# Altium schematic sheet 存在感应灯控模块-24V-8位拨码V0.2.schdoc
size A3
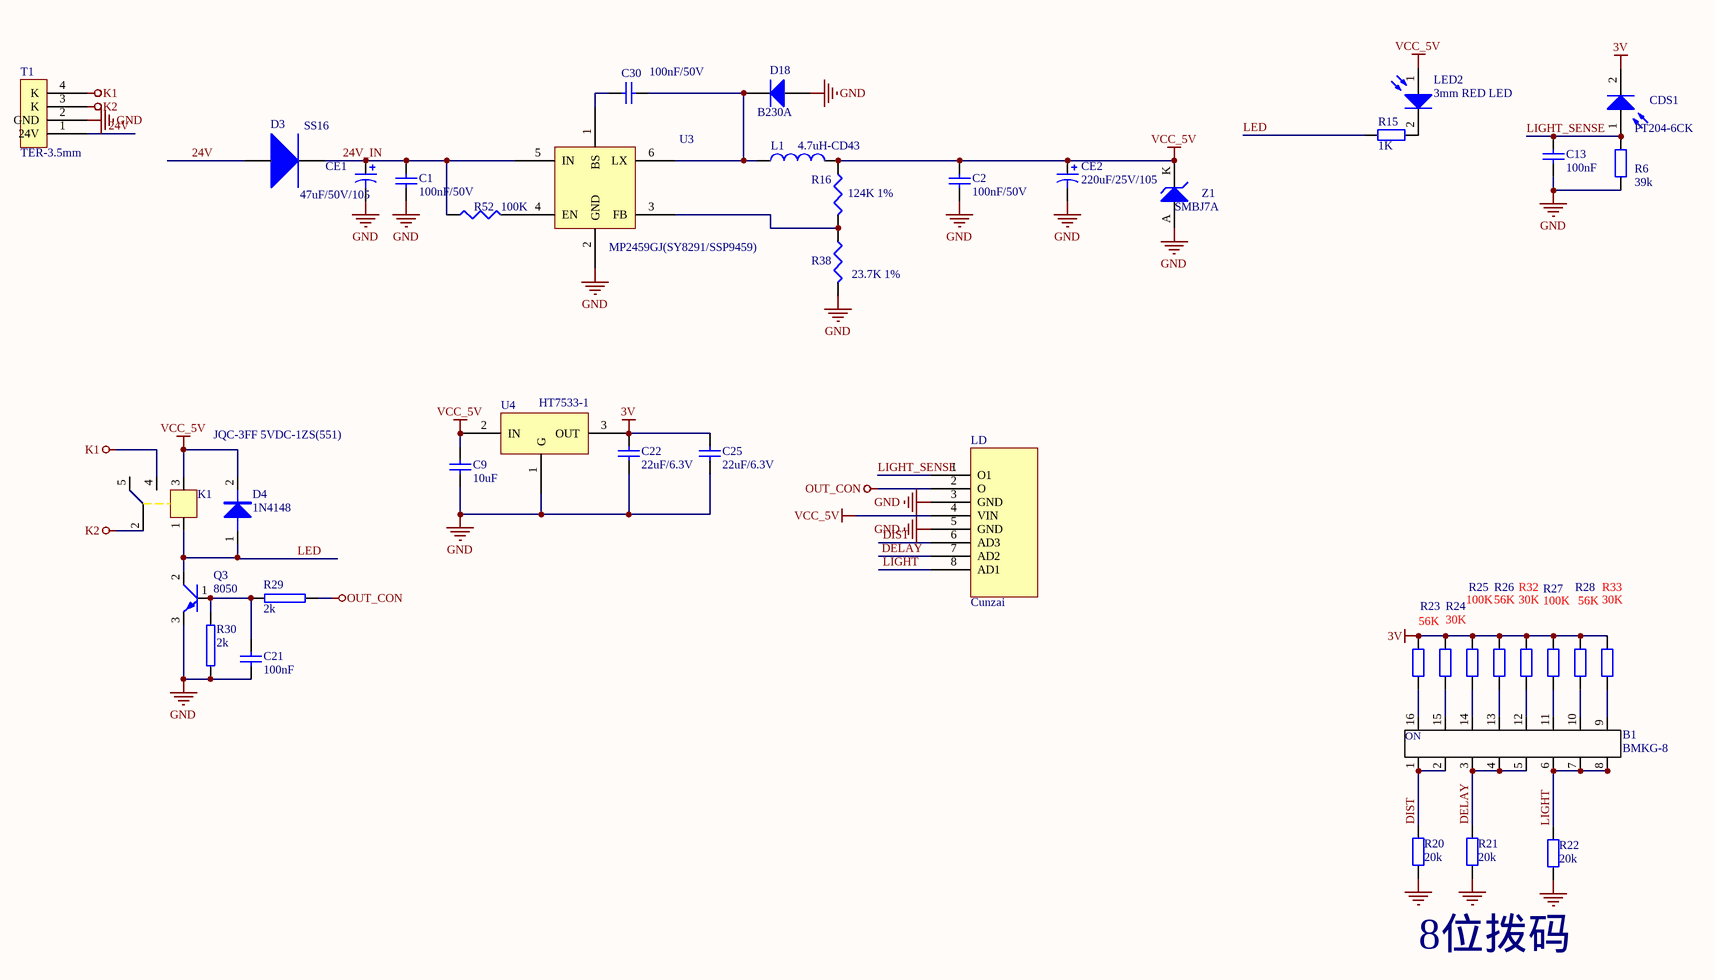
[diagram p0: 存在感应灯控模块-24V-8位拨码V0.2.schdoc]

## Parts
B1  BMKG-8  [BMKG-8]
C1  100nF/50V  [0603]
C2  100nF/50V  [0603]
C9  10uF  [C0603]
C13  100nF  [C0603]
C21  100nF  [C0603]
C22  22uF/6.3V  [C0603]
C25  22uF/6.3V  [C0603]
C30  100nF/50V  [0603]
CDS1  PT204-6CK  [LED-3MM]
CE1  47uF/50V/105  [DIPC6X12]
CE2  220uF/25V/105  [DIPC6X12]
D3  SS16  [SMA]
D4  1N4148  [SOD123]
D18  B230A  [SMA]
K1  JQC-3FF 5VDC-1ZS(551)  [JQC-3FF]
L1  4.7uH-CD43  [CDRH3D16]
LD  Cunzai  [LDCUNZAI]
LED2  3mm RED LED  [LED-3MM]
Q3  8050  [SOT23]
R6  value 39k  [R0603]  (hidden comment: Res2)
R15  value 1K  [R0603]  (hidden comment: Res2)
R16  124K 1%  [0603]
R20  20k  [R0603]
R21  20k  [R0603]
R22  20k  [R0603]
R23  56K  [R0603]
R24  30K  [R0603]
R25  100K  [R0603]
R26  56K  [R0603]
R27  100K  [R0603]
R28  56K  [R0603]
R29  2k  [SR0603]
R30  2k  [SR0603]
R32  30K  [R0603]
R33  30K  [R0603]
R38  23.7K 1%  [0603]
R52  100K  [0603]
T1  TER-3.5mm  [4-KKK]
U3  MP2459GJ(SY8291/SSP9459)  [SOT23-6]
U4  HT7533-1  [SOT-89]
Z1  SMBJ7A  [SMB]

## Nets
3V: C22.1 C25.1 CDS1.2(K) R23.2 R24.2 R25.2 R26.2 R27.2 R28.2 R32.2 R33.2 U4.3(OUT)
GND: C1.1 C2.1 C9.2 C13.1 C21.2 C22.2 C25.2 CE1.2 CE2.2 D18.1(A) LD.3(GND) LD.5(GND) Q3.3(C) R6.1 R20.1 R21.1 R22.1 R30.1 R38.2 T1.2(GND) U3.2(GND) U4.1(G) Z1.A
K1: K1.4 T1.4(K)
K2: K1.2 T1.3(K)
OUT_CON: LD.2(O) R29.2
VCC_5V: C2.2 C9.1 CE2.1 D4.2 K1.3 L1.2 LD.4(VIN) LED2.1(A) R16.1 U4.2(IN) Z1.K
24V: D3.1(B) T1.1(24V)
24V_IN: C1.2 CE1.1 D3.2(C) R52.1 U3.5(IN)
DELAY: B1.3 B1.4 B1.5 LD.7(AD2) R21.2
DIST: B1.1 B1.2 LD.6(AD3) R20.2
LED: D4.1 K1.1 Q3.2(E) R15.2
LIGHT: B1.6 B1.7 B1.8 LD.8(AD1) R22.2
LIGHT_SENSE: C13.2 CDS1.1(A) LD.1(O1) R6.2
NetB1_9: B1.9 R33.1
NetB1_10: B1.10 R28.1
NetB1_11: B1.11 R27.1
NetB1_12: B1.12 R32.1
NetB1_13: B1.13 R26.1
NetB1_14: B1.14 R25.1
NetB1_15: B1.15 R24.1
NetB1_16: B1.16 R23.1
NetC21_1: C21.1 Q3.1(B) R29.1 R30.2
NetC30_1: C30.1 D18.2(K) L1.1 U3.6(LX)
NetC30_2: C30.2 U3.1(BS)
NetLED2_2: LED2.2(K) R15.1
NetR16_2: R16.2 R38.1 U3.3(FB)
NetR52_2: R52.2 U3.4(EN)

Not connected (* = marked no-connect by the designer): K1 5

## Notes on the sheet
- 8位拨码
- (in symbol BMKG-8) ON

## Library data of the parts
C1 C2 C30 = Cap Semi: Capacitor (Semiconductor SIM Model); Published: 8-Jun-2000; LatestRevisionDate: 29-May-2009; LatestRevisionNote: IPC-7351 Footprint Added.; PackageReference: C1206; Publisher: Altium Limited; PackageDescription: Chip Capacitor; Value: 100nF/50V
C9 C13 C21 C22 C25 = Cap: Capacitor; Published: 8-Jun-2000; LatestRevisionDate: 17-Jul-2002; LatestRevisionNote: Re-released for DXP Platform.; PackageReference: RAD-0.3; Publisher: Altium Limited; PackageDescription: Radial Cap, Thru-Hole; 2 Leads; 0.3 in Pin Spacing
  C9: Value: 10uF
  C13 C21: Value: 100nF
  C22 C25: Value: 22uF/6.3V
CDS1 LED2 = Photo Sen: Photosensitive Diode; Published: 24-Mar-1999; LatestRevisionDate: 17-Jul-2002; LatestRevisionNote: Re-released for DXP Platform.; PackageReference: PIN2; Publisher: Altium Limited
  CDS1: Value: PT204-6CK
  LED2: Value: 3mm RED LED
CE1 CE2 = Cap Pol1: Polarized Capacitor (Radial); Published: 8-Jun-2000; LatestRevisionDate: 17-Jul-2002; LatestRevisionNote: Re-released for DXP Platform.; PackageReference: RB7.6-15; Publisher: Altium Limited
  CE1: Value: 47uF/50V/105
  CE2: Value: 220uF/25V/105
D3 = SS14: Value: SS16
D4 = DIODE
D18 = Diode 1N4007: 1 Amp General Purpose Rectifier; Revision 1: 11-Jul-2000: SIM Model Added.; Revision 2: 17-Jul-2002: Re-released for DXP Platform.; Package Information: Latest Revision: Aug-1999; Code - JEDEC: DO-204-AL; Published: 8-Jun-2000; Datasheet: Latest Revision: 1998; Package Reference: DO-41; Publisher: Altium Limited; Value: B230A
K1 = JDQ
L1 = Inductor: Code_IEC: 1005; Published: 8-Jun-2000; LatestRevisionDate: 17-Jul-2002; LatestRevisionNote: Re-released for DXP Platform.; PackageReference: 0402-A; Publisher: Altium Limited; Code_JEITA: 0402; Value: 4.7uH-CD43
R6 R15 R20-R22 = Res2: Resistor; Published: 8-Jun-2000; LatestRevisionDate: 17-Jul-2002; LatestRevisionNote: Re-released for DXP Platform.; PackageReference: AXIAL-0.4; Publisher: Altium Limited
  R6 R15: PackageDescription: Axial Device, Thru-Hole; 2 Leads; 0.4 in Pin Spacing
  R20-R22: Value: 20k
R16 R38 R52 = Res3: Resistor; Published: 8-Jun-2000; Revision: July-2002: Re-released for DXP Platform.; Publisher: Altium Limited
  R16: Value: 124K 1%
  R38: Value: 23.7K 1%
  R52: Value: 100K
R23 R25 R27 = Res2: Resistor; Value: 39k; Published: 8-Jun-2000; LatestRevisionDate: 17-Jul-2002; LatestRevisionNote: Re-released for DXP Platform.; PackageReference: AXIAL-0.4; Publisher: Altium Limited
R24 R26 R28 R32 R33 = Res2: Resistor; Value: 20k; Published: 8-Jun-2000; LatestRevisionDate: 17-Jul-2002; LatestRevisionNote: Re-released for DXP Platform.; PackageReference: AXIAL-0.4; Publisher: Altium Limited
R29 R30 = RES
U3 = SY8120B: Value: MP2459GJ(SY8291/SSP9459)
U4 = 12S33: Value: HT7533-1
Z1 = D Zener: Zener Diode; Published: 8-Jun-2000; LatestRevisionDate: 17-Jul-2002; LatestRevisionNote: Re-released for DXP Platform.; PackageReference: DIODE-0.7; Publisher: Altium Limited; PackageDescription: Diode, Thru-Hole; 2 Leads; 0.7 in Pin Spacing